# Altium schematic sheet 006_EEPR_DISCHAR.SchDoc
size A4; Organization: OLTEST; Revision: 01; SheetNumber: 06; SheetTotal: 12; Название листа: Название листа; Разработчик: Бондарчук С.; Прибор: R100; АМАК.000000.000 Э3: R100.220.040.000 Э3; Дата: 31.01.2017; Формат: A4
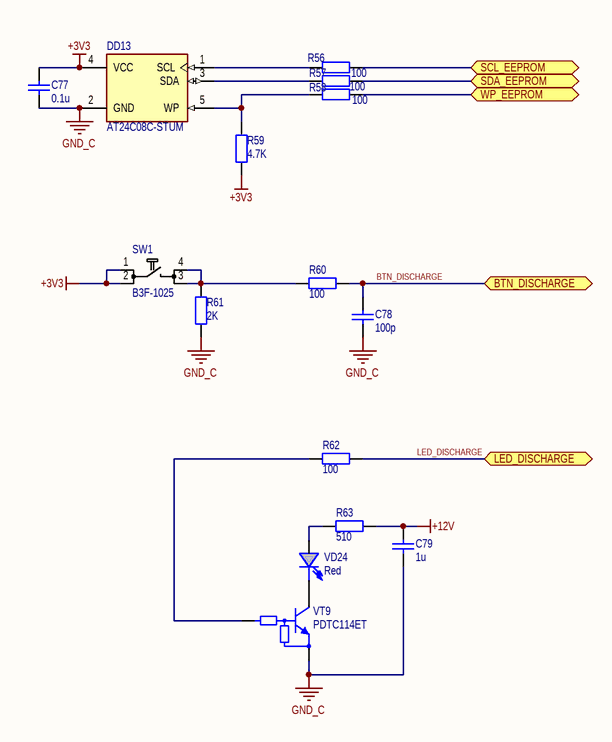
[diagram p0: 006_EEPR_DISCHAR.SchDoc]

## Parts
C77  0.1u  [SMD_C_0603]
C78  100p  [SMD_C_0603]
C79  1u  [SMD_C_0603]
DD13  AT24C08C-STUM  [5TS1]
R56  100  [SMD_R_0603]
R57  100  [SMD_R_0603]
R58  100  [SMD_R_0603]
R59  4.7K  [SMD_R_0805]
R60  100  [SMD_R_0603]
R61  2K  [SMD_R_0805]
R62  100  [SMD_R_0603]
R63  510  [SMD_R_1206]
SW1  B3F-1025  [B3F-1025 (no gnd)]
VD24  value Red  [SMD_LED_LL_Red]  (hidden comment: LL-S172SC-2S)
VT9  PDTC114ET  [SOT23-3]

## Ports
BTN_DISCHARGE, LED_DISCHARGE, SCL_EEPROM, SDA_EEPROM, WP_EEPROM

## Nets
+3V3: C77.2 DD13.4(VCC) R59.1 SW1.1 SW1.2
+12V: C79.2 R63.2
GND_C: C77.1 C78.1 C79.1 DD13.2(GND) R61.1 VT9.2(E)
BTN_DISCHARGE: C78.2 R60.2 ; port BTN_DISCHARGE
LED_DISCHARGE: R62.2 ; port LED_DISCHARGE
SCL_EEPROM: R56.2 ; port SCL_EEPROM
SDA_EEPROM: R57.2 ; port SDA_EEPROM
WP_EEPROM: R58.2 ; port WP_EEPROM
NetDD13_1: DD13.1(SCL) R56.1
NetDD13_3: DD13.3(SDA) R57.1
NetDD13_5: DD13.5(WP) R58.1 R59.2
NetR60_1: R60.1 R61.2 SW1.3 SW1.4
NetR62_1: R62.1 VT9.1(B)
NetR63_1: R63.1 VD24.1(ANODE)
NetVD24_2: VD24.2(CATHODE) VT9.3(C)

## Notes on the sheet
- Разработчик:
- Формат:
- Rev.:
- Лист
- Дата:
- Листов
- WorkSpace:
- Дата изм.:

## Library data of the parts
C77 = C0603 0.1u 50V 10%: SMD C 0603 MURATA 50V 10% X7R; PartNumber: GRM188R71H104K; Manufacturer: MURATA; Value: 0.1u
C78 = C0603 100p 100V 5%: SMD C 0603 MURATA 100V 5% NP0; PartNumber: GRM1885C2A101JA01; Manufacturer: MURATA; Value: 100p
C79 = C0603 1uF 25V 10%: SMD C 0603 MURATA 25V 10% X7R; PartNumber: GRM188R71E105KA12; Manufacturer: MURATA; Value: 1u
DD13 = AT24C08C-STUM: I2C Serial EEPROM, 8-Kbit (1024 x 8); PartNumber: AT24C08C-STUM-T; Manufacturer: ATMEL; ComponentLink1Description: Datasheet; ComponentLink1URL: \\NAS1\DataSheet\9589\AT24C08C.pdf
R56-R58 R60 R62 = R0603 100 1%: SMD R 0603 VISHAY 0.1W 75V 1% 100ppm; PartNumber: CRCW0603100RFK; Manufacturer: VISHAY; Value: 100
R59 = R0805 4.7K 1%: SMD R 0805 VISHAY 0.125W 150V 1% 100ppm; PartNumber: CRCW08054K70FK; Manufacturer: VISHAY; Value: 4.7K
R61 = R0805 2K 1%: SMD R 0805 VISHAY 0.125W 150V 1% 100ppm; PartNumber: CRCW08052K00FK; Manufacturer: VISHAY; Value: 2K
R63 = R1206 510 1%: SMD R 1206 VISHAY 0.25W 200V 1% 100ppm; PartNumber: CRCW1206510RFK; Manufacturer: VISHAY; Value: 510
SW1 = B3F-1025: 1-50mA; 5-24V; 6x6mm h=5mm; Red; Manufacturer: Omron; PartNumber: B3F-1025
VD24 = LL-S172SC-2S: LED Red SMD; Manufacturer: Lucky Light; PartNumber: LL-S172SC-2S
VT9 = PDTC114ET: Digital Transistor (BRT), R1=10 kOhm, R2=10 kOhm, NPN Transistor; Manufacturer: On Semiconductor; PartNumber: PDTC114ET